# Altium schematic sheet Hammerhead - Arduino Leonardo Shield Headers R1.1.SchDoc
size A; SheetNumber: 5
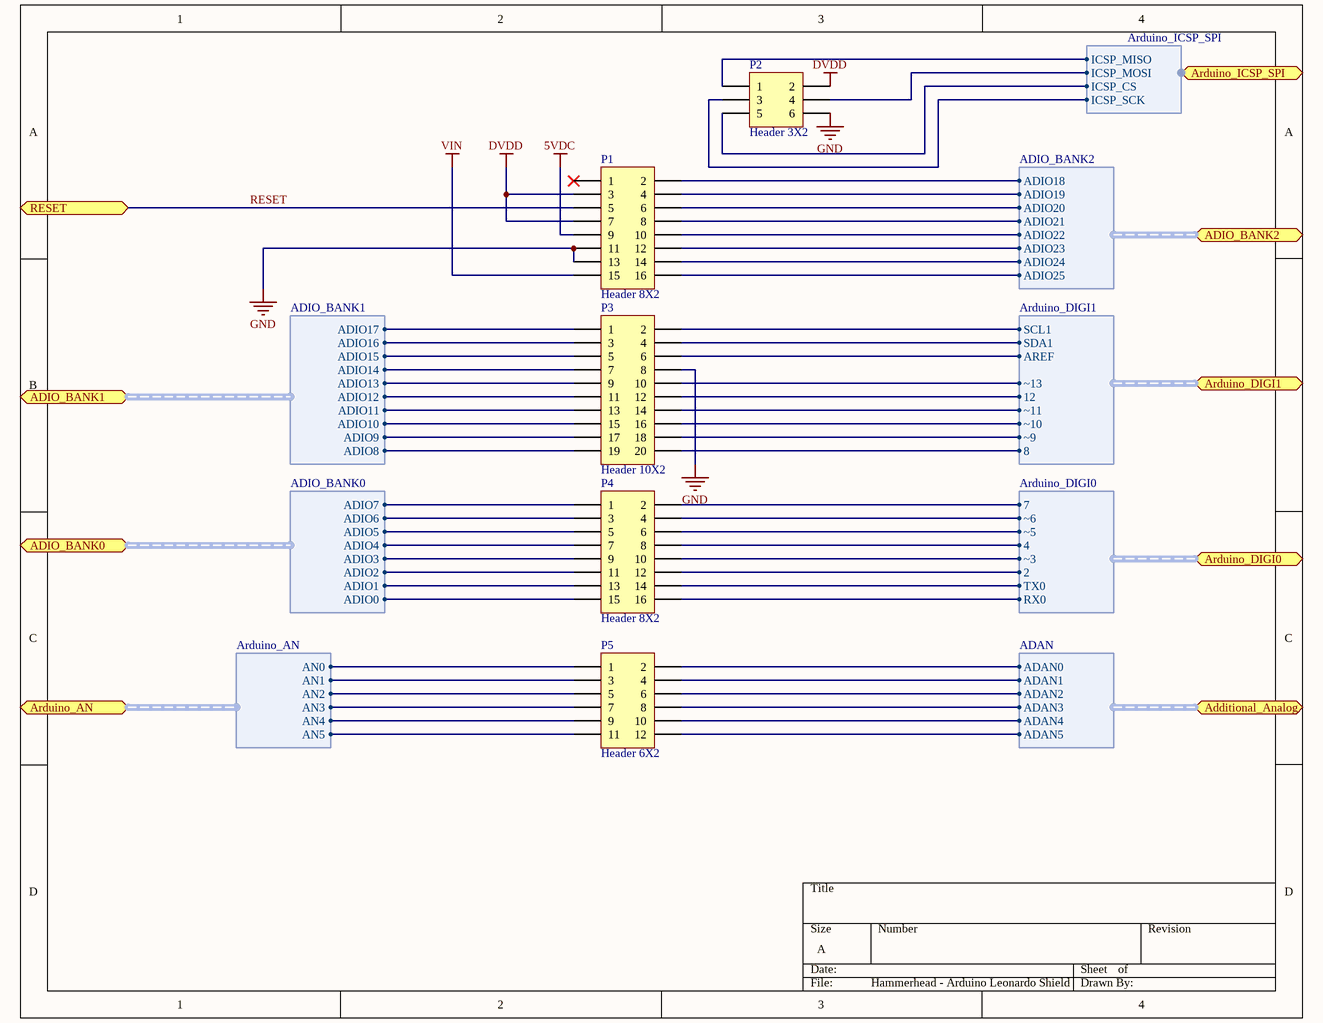
[diagram p0: Hammerhead - Arduino Leonardo Shield Headers R1.1.SchDoc]

## Parts
P1  Header 8X2  [HDR2X8]
P2  Header 3X2  [HDR2X3]
P3  Header 10X2  [HDR2X10]
P4  Header 8X2  [HDR2X8]
P5  Header 6X2  [HDR2X6]

## Ports
Additional_Analog (harness ADAN), ADIO_BANK0 (harness ADIO_BANK0), ADIO_BANK1 (harness ADIO_BANK1), ADIO_BANK2 (harness ADIO_BANK2), Arduino_AN (harness Arduino_AN), Arduino_DIGI0 (harness Arduino_DIGI0), Arduino_DIGI1 (harness Arduino_DIGI1), Arduino_ICSP_SPI (harness Arduino_ICSP_SPI), RESET

## Harnesses
Arduino_DIGI1: 8, ~9, ~10, ~11, 12, ~13, AREF, SDA1, SCL1
Arduino_DIGI0: 7, ~6, ~5, 4, ~3, 2, TX0, RX0
Arduino_AN: AN0, AN1, AN2, AN3, AN4, AN5
ADIO_BANK0: ADIO0, ADIO1, ADIO2, ADIO3, ADIO4, ADIO5, ADIO6, ADIO7
ADIO_BANK1: ADIO17, ADIO16, ADIO15, ADIO14, ADIO13, ADIO12, ADIO10, ADIO9, ADIO8, ADIO11
ADAN: ADAN0, ADAN1, ADAN2, ADAN3, ADAN4, ADAN5
Arduino_ICSP_SPI: ICSP_MOSI, ICSP_MISO, ICSP_SCK, ICSP_CS
ADIO_BANK2: ADIO18, ADIO19, ADIO20, ADIO21, ADIO22, ADIO23, ADIO24, ADIO25

## Nets
5VDC: P1.9
DVDD: P1.3 P1.7 P2.2
GND: P1.11 P1.13 P2.6 P3.8
VIN: P1.15
RESET: P1.5 ; port RESET
NetP1_2: P1.2 ; port ADIO_BANK2.ADIO18
NetP1_4: P1.4 ; port ADIO_BANK2.ADIO19
NetP1_6: P1.6 ; port ADIO_BANK2.ADIO20
NetP1_8: P1.8 ; port ADIO_BANK2.ADIO21
NetP1_10: P1.10 ; port ADIO_BANK2.ADIO22
NetP1_12: P1.12 ; port ADIO_BANK2.ADIO23
NetP1_14: P1.14 ; port ADIO_BANK2.ADIO24
NetP1_16: P1.16 ; port ADIO_BANK2.ADIO25
NetP2_1: P2.1 ; port Arduino_ICSP_SPI.ICSP_MISO
NetP2_3: P2.3 ; port Arduino_ICSP_SPI.ICSP_SCK
NetP2_4: P2.4 ; port Arduino_ICSP_SPI.ICSP_MOSI
NetP2_5: P2.5 ; port Arduino_ICSP_SPI.ICSP_CS
NetP3_1: P3.1 ; port ADIO_BANK1.ADIO17
NetP3_2: P3.2 ; port Arduino_DIGI1.SCL1
NetP3_3: P3.3 ; port ADIO_BANK1.ADIO16
NetP3_4: P3.4 ; port Arduino_DIGI1.SDA1
NetP3_5: P3.5 ; port ADIO_BANK1.ADIO15
NetP3_6: P3.6 ; port Arduino_DIGI1.AREF
NetP3_7: P3.7 ; port ADIO_BANK1.ADIO14
NetP3_9: P3.9 ; port ADIO_BANK1.ADIO13
NetP3_10: P3.10 ; port Arduino_DIGI1.~13
NetP3_11: P3.11 ; port ADIO_BANK1.ADIO12
NetP3_12: P3.12 ; port Arduino_DIGI1.12
NetP3_13: P3.13 ; port ADIO_BANK1.ADIO11
NetP3_14: P3.14 ; port Arduino_DIGI1.~11
NetP3_15: P3.15 ; port ADIO_BANK1.ADIO10
NetP3_16: P3.16 ; port Arduino_DIGI1.~10
NetP3_17: P3.17 ; port ADIO_BANK1.ADIO9
NetP3_18: P3.18 ; port Arduino_DIGI1.~9
NetP3_19: P3.19 ; port ADIO_BANK1.ADIO8
NetP3_20: P3.20 ; port Arduino_DIGI1.8
NetP4_1: P4.1 ; port ADIO_BANK0.ADIO7
NetP4_2: P4.2 ; port Arduino_DIGI0.7
NetP4_3: P4.3 ; port ADIO_BANK0.ADIO6
NetP4_4: P4.4 ; port Arduino_DIGI0.~6
NetP4_5: P4.5 ; port ADIO_BANK0.ADIO5
NetP4_6: P4.6 ; port Arduino_DIGI0.~5
NetP4_7: P4.7 ; port ADIO_BANK0.ADIO4
NetP4_8: P4.8 ; port Arduino_DIGI0.4
NetP4_9: P4.9 ; port ADIO_BANK0.ADIO3
NetP4_10: P4.10 ; port Arduino_DIGI0.~3
NetP4_11: P4.11 ; port ADIO_BANK0.ADIO2
NetP4_12: P4.12 ; port Arduino_DIGI0.2
NetP4_13: P4.13 ; port ADIO_BANK0.ADIO1
NetP4_14: P4.14 ; port Arduino_DIGI0.TX0
NetP4_15: P4.15 ; port ADIO_BANK0.ADIO0
NetP4_16: P4.16 ; port Arduino_DIGI0.RX0
NetP5_1: P5.1 ; port Arduino_AN.AN0
NetP5_2: P5.2 ; port Additional_Analog.ADAN0
NetP5_3: P5.3 ; port Arduino_AN.AN1
NetP5_4: P5.4 ; port Additional_Analog.ADAN1
NetP5_5: P5.5 ; port Arduino_AN.AN2
NetP5_6: P5.6 ; port Additional_Analog.ADAN2
NetP5_7: P5.7 ; port Arduino_AN.AN3
NetP5_8: P5.8 ; port Additional_Analog.ADAN3
NetP5_9: P5.9 ; port Arduino_AN.AN4
NetP5_10: P5.10 ; port Additional_Analog.ADAN4
NetP5_11: P5.11 ; port Arduino_AN.AN5
NetP5_12: P5.12 ; port Additional_Analog.ADAN5

Not connected (* = marked no-connect by the designer): P1 1*

## Library data of the parts
P1 P4 = Header 8X2: Header, 8-Pin, Dual row; LatestRevisionDate: 17-Jul-2002; LatestRevisionNote: Re-released for DXP Platform.; Publisher: Altium Limited
P2 = Header 3X2: Header, 3-Pin, Dual row; LatestRevisionDate: 17-Jul-2002; LatestRevisionNote: Re-released for DXP Platform.; Publisher: Altium Limited
P3 = Header 10X2: Header, 10-Pin, Dual row; LatestRevisionDate: 17-Jul-2002; LatestRevisionNote: Re-released for DXP Platform.; Publisher: Altium Limited
P5 = Header 6X2: Header, 6-Pin, Dual row; LatestRevisionDate: 17-Jul-2002; LatestRevisionNote: Re-released for DXP Platform.; Publisher: Altium Limited